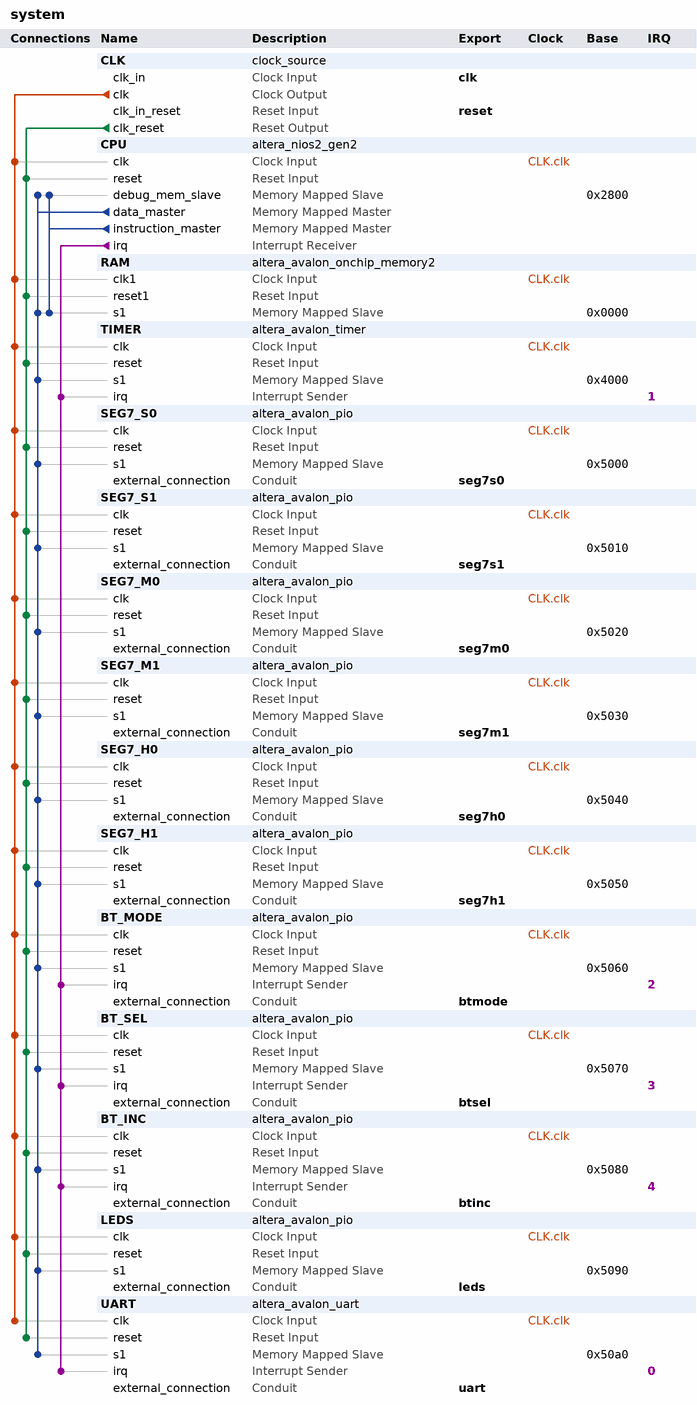
[diagram p0: system contents]
# Platform Designer (Qsys) system system, Cyclone V 5CSEMA5F31C6
# Parameters at their usual value, and those the tool derives, are not listed.
package require -exact qsys 20.1
create_system system
set_project_property DEVICE_FAMILY {Cyclone V}
set_project_property DEVICE 5CSEMA5F31C6

add_instance CLK clock_source 20.1
set_instance_parameter_value CLK clockFrequency 50000000

add_instance CPU altera_nios2_gen2 20.1
set_instance_parameter_value CPU dcache_size 2048
set_instance_parameter_value CPU exceptionSlave RAM.s1
set_instance_parameter_value CPU icache_size 4096
set_instance_parameter_value CPU impl Tiny
set_instance_parameter_value CPU resetSlave RAM.s1

add_instance RAM altera_avalon_onchip_memory2 20.1
set_instance_parameter_value RAM dataWidth 32
set_instance_parameter_value RAM dualPort false
set_instance_parameter_value RAM initMemContent true
set_instance_parameter_value RAM initializationFileName onchip_mem.hex
set_instance_parameter_value RAM memorySize 5120

add_instance TIMER altera_avalon_timer 20.1
set_instance_parameter_value TIMER period 1
set_instance_parameter_value TIMER periodUnits SEC

add_instance SEG7_S0 altera_avalon_pio 20.1
set_instance_parameter_value SEG7_S0 direction Output
set_instance_parameter_value SEG7_S0 width 7

add_instance SEG7_S1 altera_avalon_pio 20.1
set_instance_parameter_value SEG7_S1 direction Output
set_instance_parameter_value SEG7_S1 width 7

add_instance SEG7_M0 altera_avalon_pio 20.1
set_instance_parameter_value SEG7_M0 direction Output
set_instance_parameter_value SEG7_M0 width 7

add_instance SEG7_M1 altera_avalon_pio 20.1
set_instance_parameter_value SEG7_M1 direction Output
set_instance_parameter_value SEG7_M1 width 7

add_instance SEG7_H0 altera_avalon_pio 20.1
set_instance_parameter_value SEG7_H0 direction Output
set_instance_parameter_value SEG7_H0 width 7

add_instance SEG7_H1 altera_avalon_pio 20.1
set_instance_parameter_value SEG7_H1 direction Output
set_instance_parameter_value SEG7_H1 width 7

add_instance BT_MODE altera_avalon_pio 20.1
set_instance_parameter_value BT_MODE captureEdge true
set_instance_parameter_value BT_MODE direction Input
set_instance_parameter_value BT_MODE generateIRQ true
set_instance_parameter_value BT_MODE irqType EDGE
set_instance_parameter_value BT_MODE width 1

add_instance BT_SEL altera_avalon_pio 20.1
set_instance_parameter_value BT_SEL captureEdge true
set_instance_parameter_value BT_SEL direction Input
set_instance_parameter_value BT_SEL generateIRQ true
set_instance_parameter_value BT_SEL irqType EDGE
set_instance_parameter_value BT_SEL width 1

add_instance BT_INC altera_avalon_pio 20.1
set_instance_parameter_value BT_INC captureEdge true
set_instance_parameter_value BT_INC direction Input
set_instance_parameter_value BT_INC generateIRQ true
set_instance_parameter_value BT_INC irqType EDGE
set_instance_parameter_value BT_INC width 1

add_instance LEDS altera_avalon_pio 20.1
set_instance_parameter_value LEDS direction Output
set_instance_parameter_value LEDS width 8

add_instance UART altera_avalon_uart 20.1
set_instance_parameter_value UART baud 115200
set_instance_parameter_value UART dataBits 8
set_instance_parameter_value UART fixedBaud true
set_instance_parameter_value UART parity NONE
set_instance_parameter_value UART stopBits 1

# connections
add_connection CLK.clk BT_INC.clk clock
add_connection CLK.clk BT_MODE.clk clock
add_connection CLK.clk BT_SEL.clk clock
add_connection CLK.clk CPU.clk clock
add_connection CLK.clk LEDS.clk clock
add_connection CLK.clk RAM.clk1 clock
add_connection CLK.clk SEG7_H0.clk clock
add_connection CLK.clk SEG7_H1.clk clock
add_connection CLK.clk SEG7_M0.clk clock
add_connection CLK.clk SEG7_M1.clk clock
add_connection CLK.clk SEG7_S0.clk clock
add_connection CLK.clk SEG7_S1.clk clock
add_connection CLK.clk TIMER.clk clock
add_connection CLK.clk UART.clk clock
add_connection CLK.clk_reset BT_INC.reset reset
add_connection CLK.clk_reset BT_MODE.reset reset
add_connection CLK.clk_reset BT_SEL.reset reset
add_connection CLK.clk_reset CPU.reset reset
add_connection CLK.clk_reset LEDS.reset reset
add_connection CLK.clk_reset RAM.reset1 reset
add_connection CLK.clk_reset SEG7_H0.reset reset
add_connection CLK.clk_reset SEG7_H1.reset reset
add_connection CLK.clk_reset SEG7_M0.reset reset
add_connection CLK.clk_reset SEG7_M1.reset reset
add_connection CLK.clk_reset SEG7_S0.reset reset
add_connection CLK.clk_reset SEG7_S1.reset reset
add_connection CLK.clk_reset TIMER.reset reset
add_connection CLK.clk_reset UART.reset reset
add_connection CPU.data_master BT_INC.s1 avalon
set_connection_parameter_value CPU.data_master/BT_INC.s1 baseAddress 0x5080
add_connection CPU.data_master BT_MODE.s1 avalon
set_connection_parameter_value CPU.data_master/BT_MODE.s1 baseAddress 0x5060
add_connection CPU.data_master BT_SEL.s1 avalon
set_connection_parameter_value CPU.data_master/BT_SEL.s1 baseAddress 0x5070
add_connection CPU.data_master CPU.debug_mem_slave avalon
set_connection_parameter_value CPU.data_master/CPU.debug_mem_slave baseAddress 0x2800
add_connection CPU.data_master LEDS.s1 avalon
set_connection_parameter_value CPU.data_master/LEDS.s1 baseAddress 0x5090
add_connection CPU.data_master RAM.s1 avalon
set_connection_parameter_value CPU.data_master/RAM.s1 baseAddress 0x0000
add_connection CPU.data_master SEG7_H0.s1 avalon
set_connection_parameter_value CPU.data_master/SEG7_H0.s1 baseAddress 0x5040
add_connection CPU.data_master SEG7_H1.s1 avalon
set_connection_parameter_value CPU.data_master/SEG7_H1.s1 baseAddress 0x5050
add_connection CPU.data_master SEG7_M0.s1 avalon
set_connection_parameter_value CPU.data_master/SEG7_M0.s1 baseAddress 0x5020
add_connection CPU.data_master SEG7_M1.s1 avalon
set_connection_parameter_value CPU.data_master/SEG7_M1.s1 baseAddress 0x5030
add_connection CPU.data_master SEG7_S0.s1 avalon
set_connection_parameter_value CPU.data_master/SEG7_S0.s1 baseAddress 0x5000
add_connection CPU.data_master SEG7_S1.s1 avalon
set_connection_parameter_value CPU.data_master/SEG7_S1.s1 baseAddress 0x5010
add_connection CPU.data_master TIMER.s1 avalon
set_connection_parameter_value CPU.data_master/TIMER.s1 baseAddress 0x4000
add_connection CPU.data_master UART.s1 avalon
set_connection_parameter_value CPU.data_master/UART.s1 baseAddress 0x50a0
add_connection CPU.instruction_master CPU.debug_mem_slave avalon
set_connection_parameter_value CPU.instruction_master/CPU.debug_mem_slave baseAddress 0x2800
add_connection CPU.instruction_master RAM.s1 avalon
set_connection_parameter_value CPU.instruction_master/RAM.s1 baseAddress 0x0000
add_connection CPU.irq BT_INC.irq interrupt
set_connection_parameter_value CPU.irq/BT_INC.irq irqNumber 4
add_connection CPU.irq BT_MODE.irq interrupt
set_connection_parameter_value CPU.irq/BT_MODE.irq irqNumber 2
add_connection CPU.irq BT_SEL.irq interrupt
set_connection_parameter_value CPU.irq/BT_SEL.irq irqNumber 3
add_connection CPU.irq TIMER.irq interrupt
set_connection_parameter_value CPU.irq/TIMER.irq irqNumber 1
add_connection CPU.irq UART.irq interrupt
set_connection_parameter_value CPU.irq/UART.irq irqNumber 0

# exported interfaces
add_interface btinc conduit end
set_interface_property btinc EXPORT_OF BT_INC.external_connection
add_interface btmode conduit end
set_interface_property btmode EXPORT_OF BT_MODE.external_connection
add_interface btsel conduit end
set_interface_property btsel EXPORT_OF BT_SEL.external_connection
add_interface clk clock sink
set_interface_property clk EXPORT_OF CLK.clk_in
add_interface leds conduit end
set_interface_property leds EXPORT_OF LEDS.external_connection
add_interface reset reset sink
set_interface_property reset EXPORT_OF CLK.clk_in_reset
add_interface seg7h0 conduit end
set_interface_property seg7h0 EXPORT_OF SEG7_H0.external_connection
add_interface seg7h1 conduit end
set_interface_property seg7h1 EXPORT_OF SEG7_H1.external_connection
add_interface seg7m0 conduit end
set_interface_property seg7m0 EXPORT_OF SEG7_M0.external_connection
add_interface seg7m1 conduit end
set_interface_property seg7m1 EXPORT_OF SEG7_M1.external_connection
add_interface seg7s0 conduit end
set_interface_property seg7s0 EXPORT_OF SEG7_S0.external_connection
add_interface seg7s1 conduit end
set_interface_property seg7s1 EXPORT_OF SEG7_S1.external_connection
add_interface uart conduit end
set_interface_property uart EXPORT_OF UART.external_connection

set_interconnect_requirement {$system} qsys_mm.clockCrossingAdapter HANDSHAKE
set_interconnect_requirement {$system} qsys_mm.enableEccProtection FALSE
set_interconnect_requirement {$system} qsys_mm.insertDefaultSlave FALSE
set_interconnect_requirement {$system} qsys_mm.maxAdditionalLatency 1

save_system system.qsys
